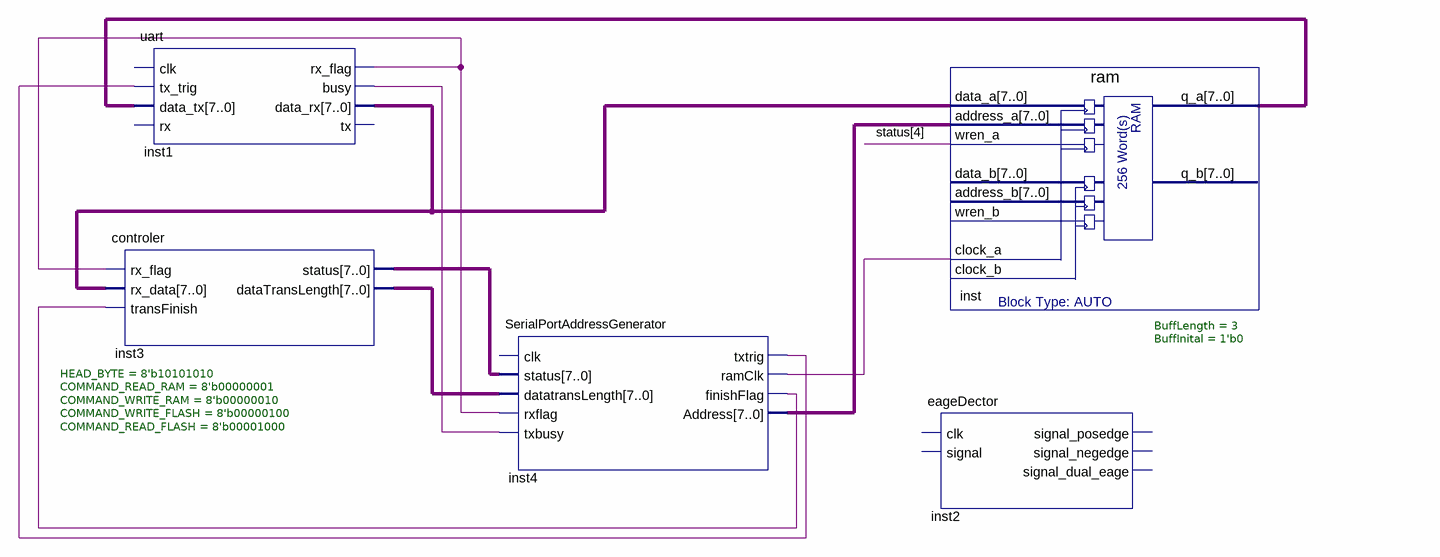
[diagram p0: schematic sheet]
// Quartus schematic top.bdf as structural Verilog: 5 symbols, 0 pins
module top (
);

  wire inst1_busy, inst1_rx_flag, inst4_finishflag, inst4_ramclk, inst4_txtrig;
  wire [4:4] status;
  wire [7:0] inst1_data_rx, inst3_datatranslength, inst3_status, inst4_address, inst_q_a;

  controler #(.HEAD_BYTE(8'b10101010), .COMMAND_READ_RAM(8'b00000001), .COMMAND_WRITE_RAM(8'b00000010), .COMMAND_WRITE_FLASH(8'b00000100), .COMMAND_READ_FLASH(8'b00001000)) inst3 (
    .rx_flag(inst1_rx_flag), .rx_data(inst1_data_rx), .transFinish(inst4_finishflag), .status(inst3_status),
    .dataTransLength(inst3_datatranslength));
  uart inst1 (
    .tx_trig(inst4_txtrig), .data_tx(inst_q_a), .rx_flag(inst1_rx_flag), .busy(inst1_busy),
    .data_rx(inst1_data_rx));  // open: clk, rx, tx
  SerialPortAddressGenerator inst4 (
    .status(inst3_status), .datatransLength(inst3_datatranslength), .rxflag(inst1_rx_flag),
    .txbusy(inst1_busy), .txtrig(inst4_txtrig), .ramClk(inst4_ramclk), .finishFlag(inst4_finishflag),
    .Address(inst4_address));  // open: clk
  ram inst (
    .data_a(inst1_data_rx), .address_a(inst4_address), .wren_a(status[4]), .clock_a(inst4_ramclk),
    .q_a(inst_q_a));  // open: data_b, address_b, wren_b, clock_b, q_b
  eageDector #(.BuffLength(3), .BuffInital(1'b0)) inst2 ();  // open: clk, signal, signal_posedge, signal_negedge, signal_dual_eage
endmodule
